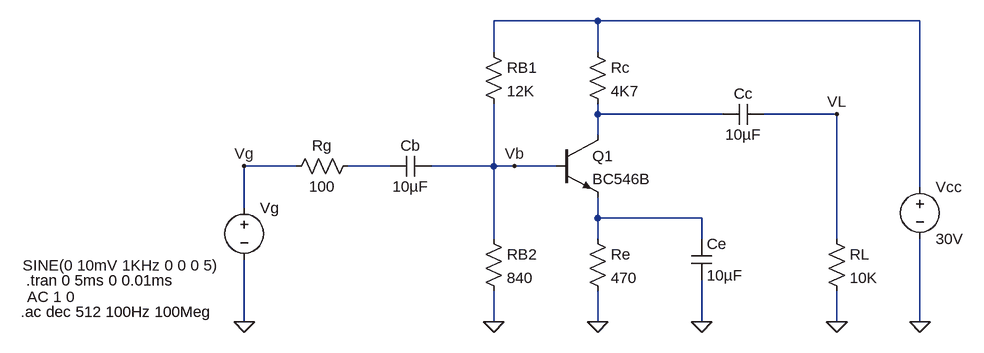
[diagram p0: schematic Draft3.asc]
Draft3.asc, the LTspice schematic file:
Version 4
SHEET 1 1160 680
WIRE 592 -176 432 -176
WIRE 1088 -176 592 -176
WIRE 432 -128 432 -176
WIRE 592 -128 592 -176
WIRE 592 -32 592 -48
WIRE 784 -32 592 -32
WIRE 960 -32 848 -32
WIRE 592 0 592 -32
WIRE 128 48 48 48
WIRE 272 48 208 48
WIRE 432 48 432 -48
WIRE 432 48 336 48
WIRE 464 48 432 48
WIRE 528 48 464 48
WIRE 1088 80 1088 -176
WIRE 48 112 48 48
WIRE 592 128 592 96
WIRE 752 128 592 128
WIRE 432 160 432 48
WIRE 592 160 592 128
WIRE 752 160 752 128
WIRE 960 160 960 -32
WIRE 48 288 48 192
WIRE 432 288 432 240
WIRE 592 288 592 240
WIRE 752 288 752 224
WIRE 960 288 960 240
WIRE 1088 288 1088 160
FLAG 48 288 0
FLAG 432 288 0
FLAG 48 48 Vg
FLAG 960 288 0
FLAG 752 288 0
FLAG 592 288 0
FLAG 464 48 Vb
FLAG 1088 288 0
FLAG 960 -32 VL
SYMBOL voltage 48 96 R0
WINDOW 3 -341 105 Left 2
WINDOW 123 -334 153 Left 2
WINDOW 39 0 0 Left 0
SYMATTR Value SINE(0 10mV 1KHz 0 0 0 5)
SYMATTR Value2 AC 1 0
SYMATTR InstName Vg
SYMBOL res 224 32 R90
WINDOW 0 0 56 VBottom 2
WINDOW 3 32 56 VTop 2
SYMATTR InstName Rg
SYMATTR Value 100
SYMBOL cap 336 32 R90
WINDOW 0 0 32 VBottom 2
WINDOW 3 32 32 VTop 2
SYMATTR InstName Cb
SYMATTR Value 10µF
SYMBOL res 416 -144 R0
SYMATTR InstName RB1
SYMATTR Value 12K
SYMBOL res 416 144 R0
SYMATTR InstName RB2
SYMATTR Value 840
SYMBOL npn 528 0 R0
SYMATTR InstName Q1
SYMATTR Value BC546B
SYMBOL res 576 -144 R0
SYMATTR InstName Rc
SYMATTR Value 4K7
SYMBOL cap 848 -48 R90
WINDOW 0 0 32 VBottom 2
WINDOW 3 32 32 VTop 2
SYMATTR InstName Cc
SYMATTR Value 10µF
SYMBOL res 944 144 R0
SYMATTR InstName RL
SYMATTR Value 10K
SYMBOL cap 736 160 R0
SYMATTR InstName Ce
SYMATTR Value 10µF
SYMBOL res 576 144 R0
SYMATTR InstName Re
SYMATTR Value 470
SYMBOL voltage 1088 64 R0
WINDOW 123 0 0 Left 0
WINDOW 39 0 0 Left 0
SYMATTR InstName Vcc
SYMATTR Value 30V
TEXT -296 272 Left 2 !.ac dec 512 100Hz 100Meg
TEXT -288 224 Left 2 !.tran 0 5ms 0 0.01ms

The netlist it stands for:
* Draft3.asc
Vg Vg 0 SINE(0 10mV 1KHz 0 0 0 5) AC 1 0
Rg N003 Vg 100
Cb Vb N003 10µF
RB1 N001 Vb 12K
RB2 Vb 0 840
Q1 N002 Vb N004 0 BC546B
Rc N001 N002 4K7
Cc VL N002 10µF
RL VL 0 10K
Ce N004 0 10µF
Re N004 0 470
Vcc N001 0 30V
.model NPN NPN
.model PNP PNP
.lib standard.bjt
.ac dec 512 100Hz 100Meg
.tran 0 5ms 0 0.01ms
.backanno
.end